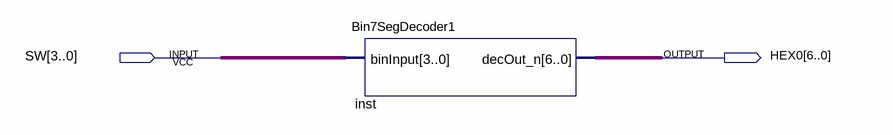
[diagram p0: schematic sheet]
// Quartus schematic DisplayDemo1.bdf as structural Verilog: 1 symbols, 2 pins
module DisplayDemo1 (
  input  [3:0] SW,
  output [6:0] HEX0
);

  Bin7SegDecoder1 inst (.binInput(SW), .decOut_n(HEX0));
endmodule
